# Altium schematic sheet 13. SOC EMIF1 & LPDDR4.SchDoc: LPDDR4 INTERFACE - 2
size 513 x 386 mm; Project: PROC154E2(001)_SK_AM69; Issue: 1.0; RevCode: E3; Page Create Date: March  8, 1995; Variant Name: Core Design; Schematic Page Number: 13; Page Number: 13; Page Size: C; Comment: MISTRAL_TITLEBLK_CSIZE_1; Page Count: 62; Schematic Page Count: 62; Name: PROC154E2 001 SK AM69; DsnPath: C:\Users\danie\Downloads\sprr466c\PROC154E3_RP\PROC154E3_SCH.DSN; SchematicName: SCHEMATIC1; PageName: 13. SOC EMIF1 & LPDDR4; PageSize: C; TopSchematic: True
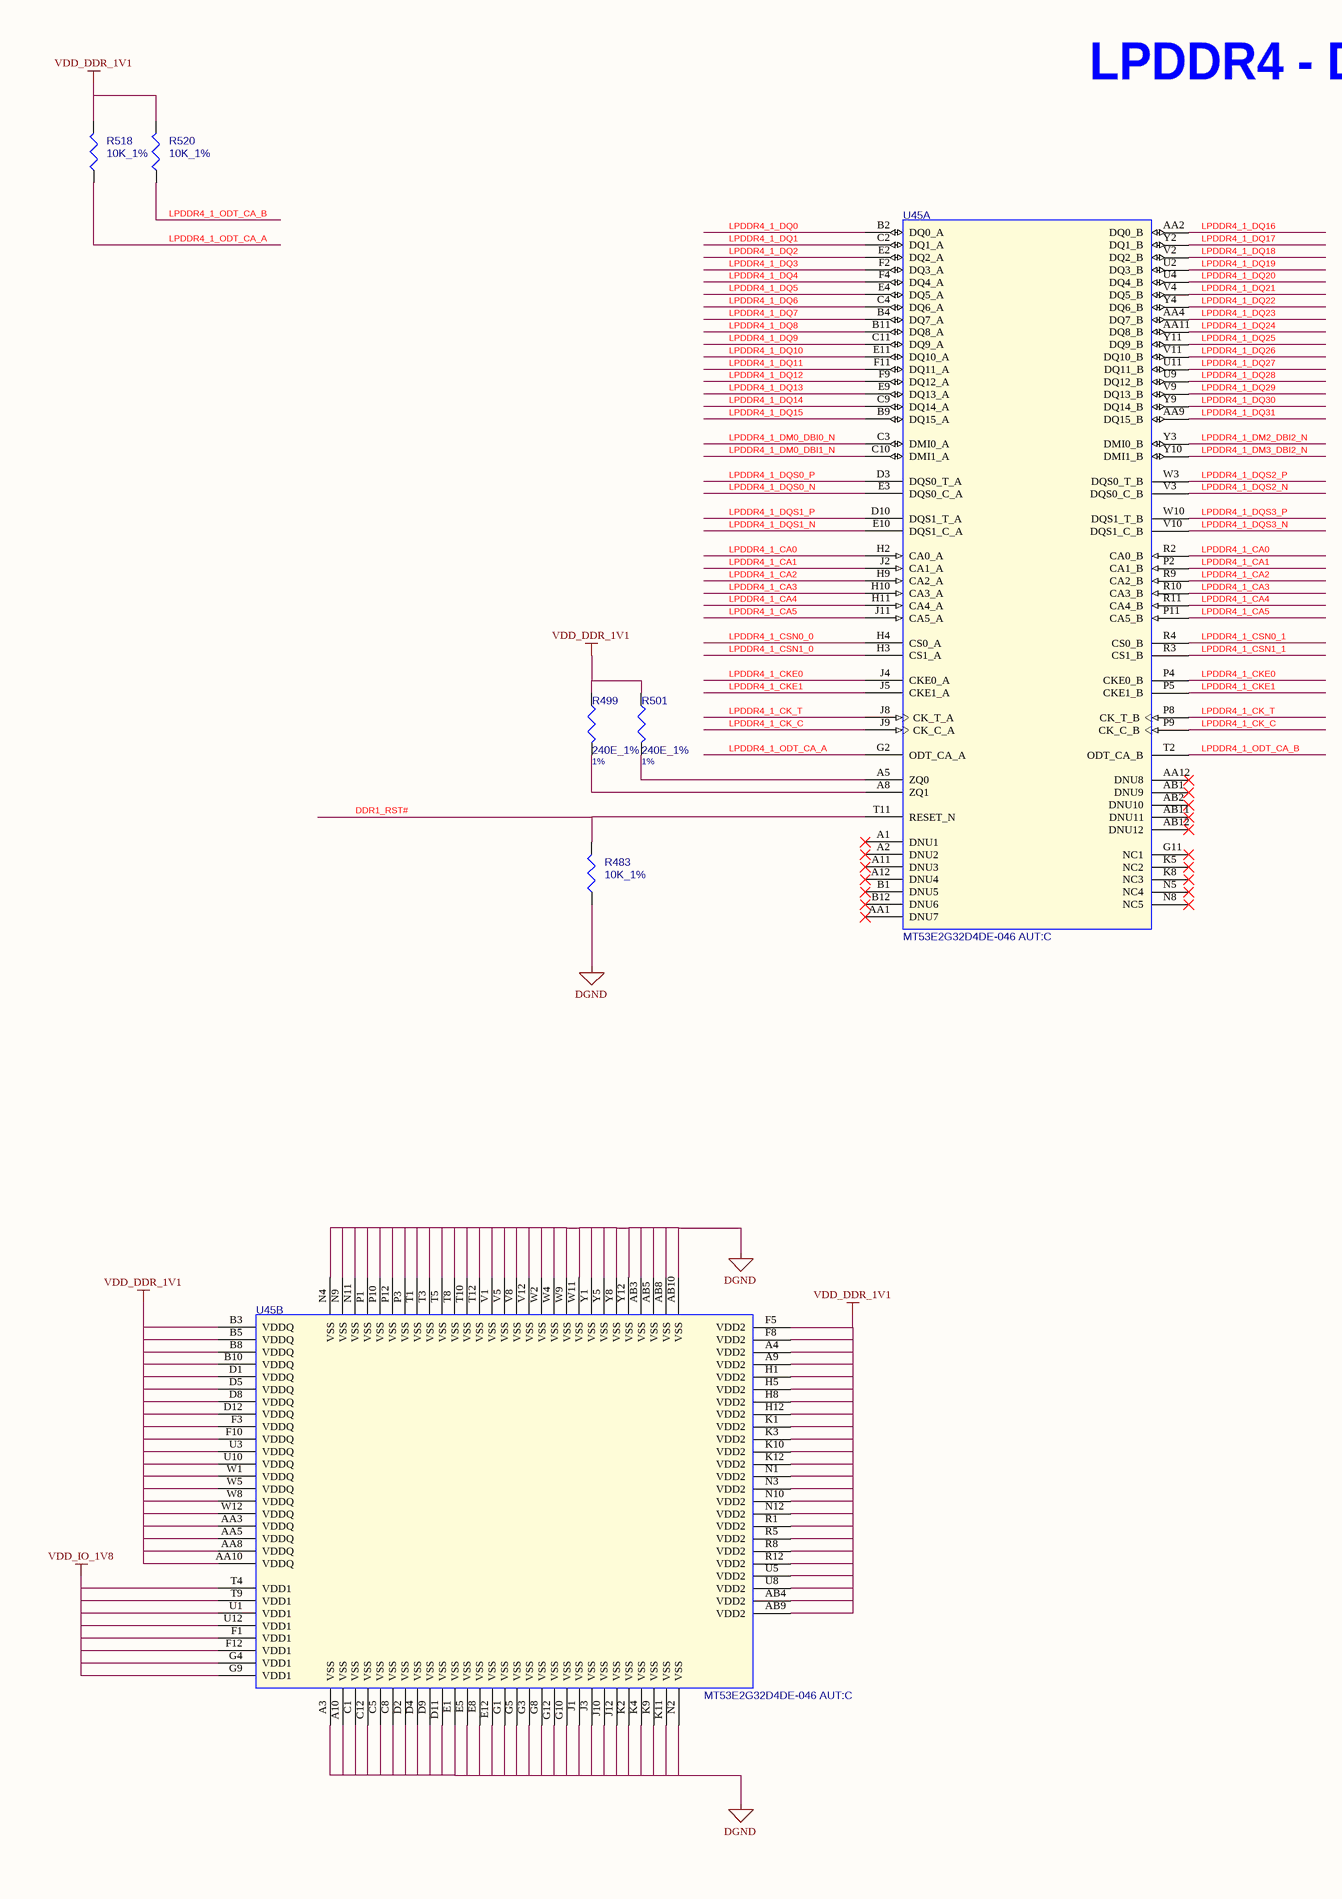
[diagram p0: 13. SOC EMIF1 & LPDDR4.SchDoc, left]
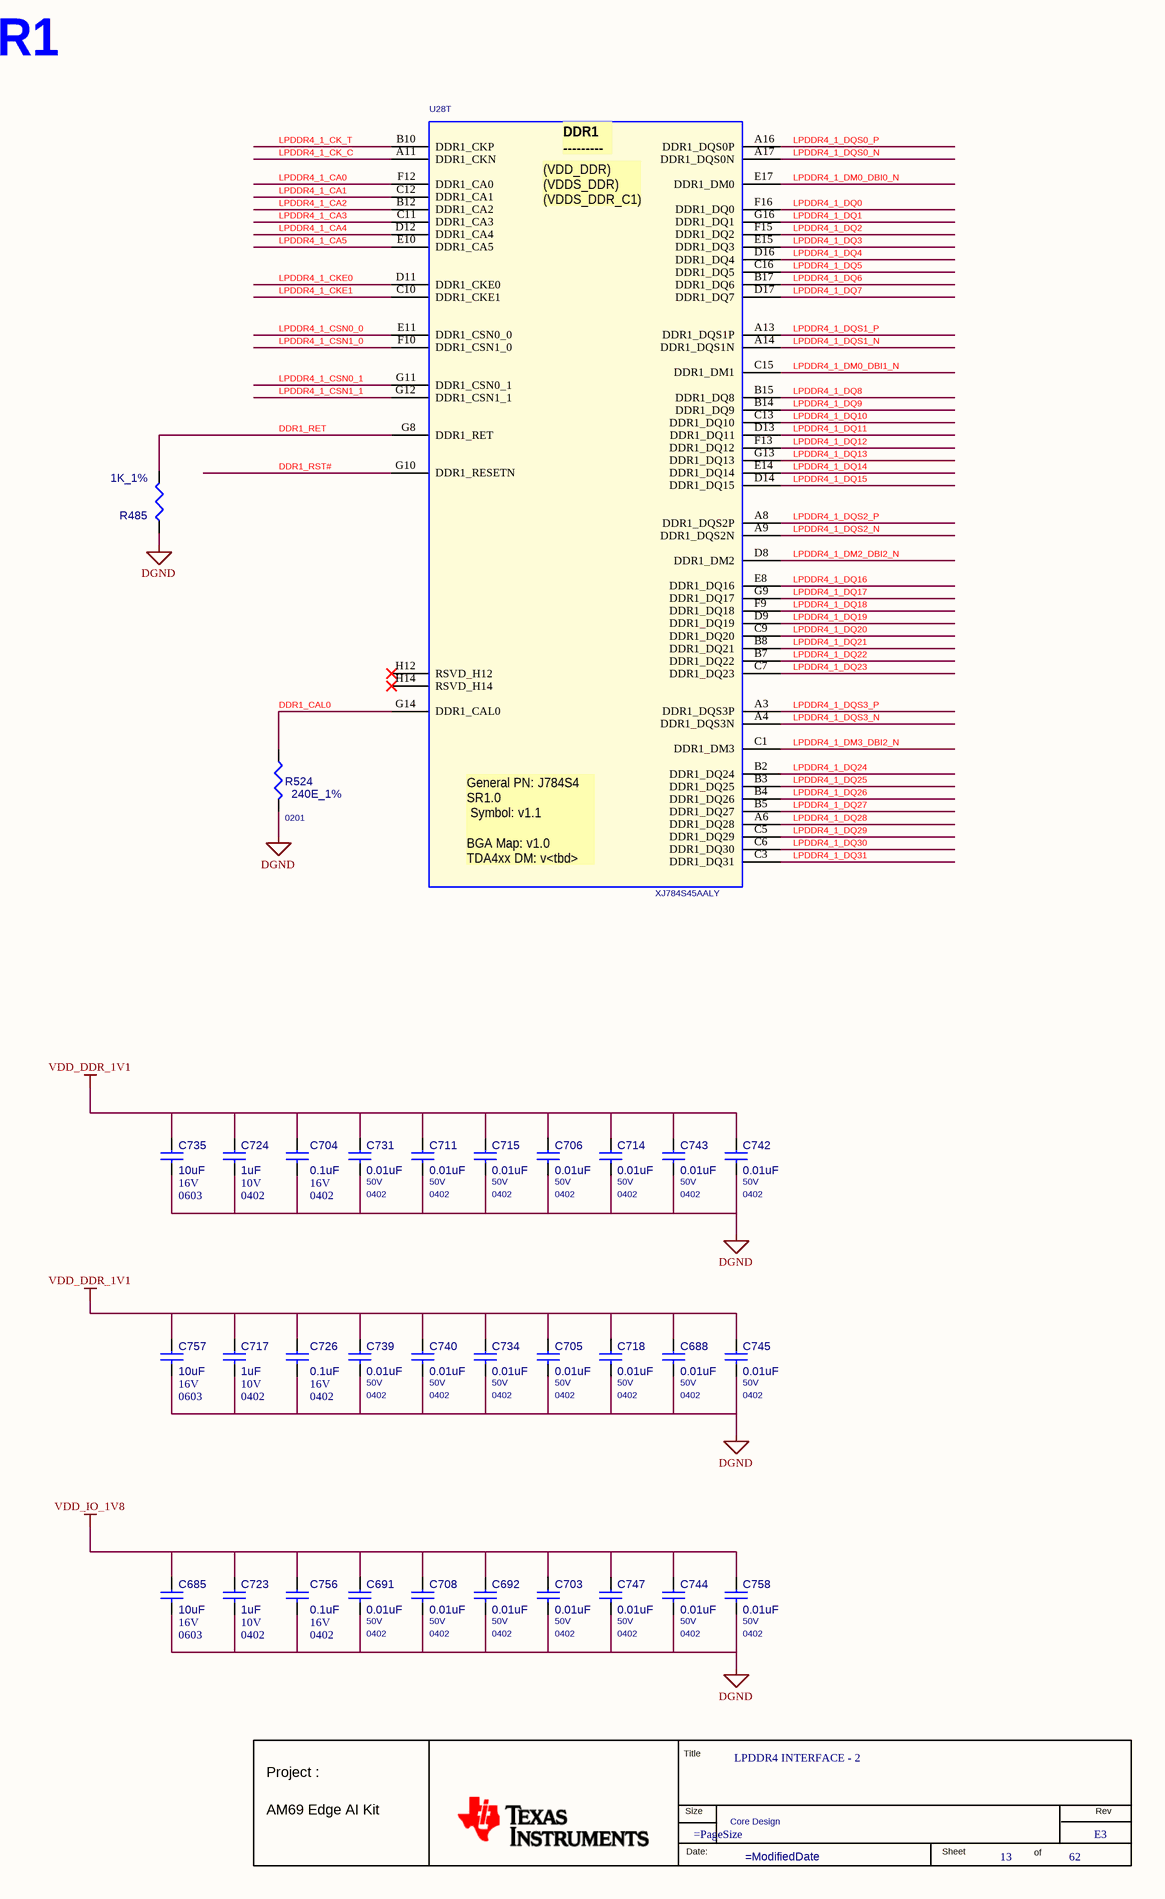
[diagram p1: 13. SOC EMIF1 & LPDDR4.SchDoc, right]

## Parts
*  RevCode: E3  Title: LPDDR4 INTERFACE - 2  Page Number: 13  Page Count: 62  Variant Name: Core Design  (hidden comment: MISTRAL_TITLEBLK_CSIZE_1)  (graphical)
C685  10uF  Package: 0603  Voltage: 16V  [CAP0603_1]
C688  0.01uF  Package: 0402  Voltage: 50V  [CAP0402_0-75]
C691  0.01uF  Voltage: 50V  Package: 0402  [CAP0402_0-75]
C692  0.01uF  Voltage: 50V  Package: 0402  [CAP0402_0-75]
C703  0.01uF  Voltage: 50V  Package: 0402  [CAP0402_0-75]
C704  0.1uF  Package: 0402  Voltage: 16V  [CAP0402_0-75]
C705  0.01uF  Package: 0402  Voltage: 50V  [CAP0402_0-75]
C706  0.01uF  Voltage: 50V  Package: 0402  [CAP0402_0-75]
C708  0.01uF  Voltage: 50V  Package: 0402  [CAP0402_0-75]
C711  0.01uF  Voltage: 50V  Package: 0402  [CAP0402_0-75]
C714  0.01uF  Voltage: 50V  Package: 0402  [CAP0402_0-75]
C715  0.01uF  Voltage: 50V  Package: 0402  [CAP0402_0-75]
C717  1uF  Voltage: 10V  Package: 0402  [CAP0402_0-75]
C718  0.01uF  Package: 0402  Voltage: 50V  [CAP0402_0-75]
C723  1uF  Package: 0402  Voltage: 10V  [CAP0402_0-75]
C724  1uF  Package: 0402  Voltage: 10V  [CAP0402_0-75]
C726  0.1uF  Voltage: 16V  Package: 0402  [CAP0402_0-75]
C731  0.01uF  Voltage: 50V  Package: 0402  [CAP0402_0-75]
C734  0.01uF  Package: 0402  Voltage: 50V  [CAP0402_0-75]
C735  10uF  Package: 0603  Voltage: 16V  [CAP0603_1]
C739  0.01uF  Package: 0402  Voltage: 50V  [CAP0402_0-75]
C740  0.01uF  Package: 0402  Voltage: 50V  [CAP0402_0-75]
C742  0.01uF  Voltage: 50V  Package: 0402  [CAP0402_0-75]
C743  0.01uF  Voltage: 50V  Package: 0402  [CAP0402_0-75]
C744  0.01uF  Voltage: 50V  Package: 0402  [CAP0402_0-75]
C745  0.01uF  Package: 0402  Voltage: 50V  [CAP0402_0-75]
C747  0.01uF  Voltage: 50V  Package: 0402  [CAP0402_0-75]
C756  0.1uF  Package: 0402  Voltage: 16V  [CAP0402_0-75]
C757  10uF  Package: 0603  Voltage: 16V  [CAP0603_1]
C758  0.01uF  Voltage: 50V  Package: 0402  [CAP0402_0-75]
R483  10K_1%  [RES0402_0-5]
R485  1K_1%  [RES0402_0-5]
R499  240E_1%  Tolerance: 1%  [RES0201_0-5]
R501  240E_1%  Tolerance: 1%  [RES0201_0-5]
R518  10K_1%  [RES0402_0-5]
R520  10K_1%  [RES0402_0-5]
R524  240E_1%  Package: 0201  [RES0201_0-5]
U28  XJ784S45AALY  [BGA1414_31-49_1230X1230_2-7]  (part T of 26)
U45  MT53E2G32D4DE-046 AUT:C  [WFBGA200_MT53DDS_400X570_1-2]  (parts A,B of 2)

## Nets
DGND: C685.2 C688.2 C691.2 C692.2 C703.2 C704.2 C705.2 C706.2 C708.2 C711.2 C714.2 C715.2 C717.2 C718.2 C723.2 C724.2 C726.2 C731.2 C734.2 C735.2 C739.2 C740.2 C742.2 C743.2 C744.2 C745.2 C747.2 C756.2 C757.2 C758.2 R483.1 R485.2 R524.2 U45.A3(VSS) U45.A10(VSS) U45.AB3(VSS) U45.AB5(VSS) U45.AB8(VSS) U45.AB10(VSS) U45.C1(VSS) U45.C5(VSS) U45.C8(VSS) U45.C12(VSS) U45.D2(VSS) U45.D4(VSS) U45.D9(VSS) U45.D11(VSS) U45.E1(VSS) U45.E5(VSS) U45.E8(VSS) U45.E12(VSS) U45.G1(VSS) U45.G3(VSS) U45.G5(VSS) U45.G8(VSS) U45.G10(VSS) U45.G12(VSS) U45.J1(VSS) U45.J3(VSS) U45.J10(VSS) U45.J12(VSS) U45.K2(VSS) U45.K4(VSS) U45.K9(VSS) U45.K11(VSS) U45.N2(VSS) U45.N4(VSS) U45.N9(VSS) U45.N11(VSS) U45.P1(VSS) U45.P3(VSS) U45.P10(VSS) U45.P12(VSS) U45.T1(VSS) U45.T3(VSS) U45.T5(VSS) U45.T8(VSS) U45.T10(VSS) U45.T12(VSS) U45.V1(VSS) U45.V5(VSS) U45.V8(VSS) U45.V12(VSS) U45.W2(VSS) U45.W4(VSS) U45.W9(VSS) U45.W11(VSS) U45.Y1(VSS) U45.Y5(VSS) U45.Y8(VSS) U45.Y12(VSS)
VDD_DDR_1V1: C688.1 C704.1 C705.1 C706.1 C711.1 C714.1 C715.1 C717.1 C718.1 C724.1 C726.1 C731.1 C734.1 C735.1 C739.1 C740.1 C742.1 C743.1 C745.1 C757.1 R499.1 R501.1 R518.2 R520.2 U45.A4(VDD2) U45.A9(VDD2) U45.AA3(VDDQ) U45.AA5(VDDQ) U45.AA8(VDDQ) U45.AA10(VDDQ) U45.AB4(VDD2) U45.AB9(VDD2) U45.B3(VDDQ) U45.B5(VDDQ) U45.B8(VDDQ) U45.B10(VDDQ) U45.D1(VDDQ) U45.D5(VDDQ) U45.D8(VDDQ) U45.D12(VDDQ) U45.F3(VDDQ) U45.F5(VDD2) U45.F8(VDD2) U45.F10(VDDQ) U45.H1(VDD2) U45.H5(VDD2) U45.H8(VDD2) U45.H12(VDD2) U45.K1(VDD2) U45.K3(VDD2) U45.K10(VDD2) U45.K12(VDD2) U45.N1(VDD2) U45.N3(VDD2) U45.N10(VDD2) U45.N12(VDD2) U45.R1(VDD2) U45.R5(VDD2) U45.R8(VDD2) U45.R12(VDD2) U45.U3(VDDQ) U45.U5(VDD2) U45.U8(VDD2) U45.U10(VDDQ) U45.W1(VDDQ) U45.W5(VDDQ) U45.W8(VDDQ) U45.W12(VDDQ)
VDD_IO_1V8: C685.1 C691.1 C692.1 C703.1 C708.1 C723.1 C744.1 C747.1 C756.1 C758.1 U45.F1(VDD1) U45.F12(VDD1) U45.G4(VDD1) U45.G9(VDD1) U45.T4(VDD1) U45.T9(VDD1) U45.U1(VDD1) U45.U12(VDD1)
DDR1_CAL0: R524.1 U28.G14(DDR1_CAL0)
DDR1_RET: R485.1 U28.G8(DDR1_RET)
DDR1_RST#: R483.2 U28.G10(DDR1_RESETN) U45.T11(RESET_N)
LPDDR4_1_CA0: U28.F12(DDR1_CA0) U45.H2(CA0_A) U45.R2(CA0_B)
LPDDR4_1_CA1: U28.C12(DDR1_CA1) U45.J2(CA1_A) U45.P2(CA1_B)
LPDDR4_1_CA2: U28.B12(DDR1_CA2) U45.H9(CA2_A) U45.R9(CA2_B)
LPDDR4_1_CA3: U28.C11(DDR1_CA3) U45.H10(CA3_A) U45.R10(CA3_B)
LPDDR4_1_CA4: U28.D12(DDR1_CA4) U45.H11(CA4_A) U45.R11(CA4_B)
LPDDR4_1_CA5: U28.E10(DDR1_CA5) U45.J11(CA5_A) U45.P11(CA5_B)
LPDDR4_1_CK_C: U28.A11(DDR1_CKN) U45.J9(CK_C_A) U45.P9(CK_C_B)
LPDDR4_1_CK_T: U28.B10(DDR1_CKP) U45.J8(CK_T_A) U45.P8(CK_T_B)
LPDDR4_1_CKE0: U28.D11(DDR1_CKE0) U45.J4(CKE0_A) U45.P4(CKE0_B)
LPDDR4_1_CKE1: U28.C10(DDR1_CKE1) U45.J5(CKE1_A) U45.P5(CKE1_B)
LPDDR4_1_CSN0_0: U28.E11(DDR1_CSN0_0) U45.H4(CS0_A)
LPDDR4_1_CSN0_1: U28.G11(DDR1_CSN0_1) U45.R4(CS0_B)
LPDDR4_1_CSN1_0: U28.F10(DDR1_CSN1_0) U45.H3(CS1_A)
LPDDR4_1_CSN1_1: U28.G12(DDR1_CSN1_1) U45.R3(CS1_B)
LPDDR4_1_DM0_DBI0_N: U28.E17(DDR1_DM0) U45.C3(DMI0_A)
LPDDR4_1_DM0_DBI1_N: U28.C15(DDR1_DM1) U45.C10(DMI1_A)
LPDDR4_1_DM2_DBI2_N: U28.D8(DDR1_DM2) U45.Y3(DMI0_B)
LPDDR4_1_DM3_DBI2_N: U28.C1(DDR1_DM3) U45.Y10(DMI1_B)
LPDDR4_1_DQ0: U28.F16(DDR1_DQ0) U45.B2(DQ0_A)
LPDDR4_1_DQ1: U28.G16(DDR1_DQ1) U45.C2(DQ1_A)
LPDDR4_1_DQ2: U28.F15(DDR1_DQ2) U45.E2(DQ2_A)
LPDDR4_1_DQ3: U28.E15(DDR1_DQ3) U45.F2(DQ3_A)
LPDDR4_1_DQ4: U28.D16(DDR1_DQ4) U45.F4(DQ4_A)
LPDDR4_1_DQ5: U28.C16(DDR1_DQ5) U45.E4(DQ5_A)
LPDDR4_1_DQ6: U28.B17(DDR1_DQ6) U45.C4(DQ6_A)
LPDDR4_1_DQ7: U28.D17(DDR1_DQ7) U45.B4(DQ7_A)
LPDDR4_1_DQ8: U28.B15(DDR1_DQ8) U45.B11(DQ8_A)
LPDDR4_1_DQ9: U28.B14(DDR1_DQ9) U45.C11(DQ9_A)
LPDDR4_1_DQ10: U28.C13(DDR1_DQ10) U45.E11(DQ10_A)
LPDDR4_1_DQ11: U28.D13(DDR1_DQ11) U45.F11(DQ11_A)
LPDDR4_1_DQ12: U28.F13(DDR1_DQ12) U45.F9(DQ12_A)
LPDDR4_1_DQ13: U28.G13(DDR1_DQ13) U45.E9(DQ13_A)
LPDDR4_1_DQ14: U28.E14(DDR1_DQ14) U45.C9(DQ14_A)
LPDDR4_1_DQ15: U28.D14(DDR1_DQ15) U45.B9(DQ15_A)
LPDDR4_1_DQ16: U28.E8(DDR1_DQ16) U45.AA2(DQ0_B)
LPDDR4_1_DQ17: U28.G9(DDR1_DQ17) U45.Y2(DQ1_B)
LPDDR4_1_DQ18: U28.F9(DDR1_DQ18) U45.V2(DQ2_B)
LPDDR4_1_DQ19: U28.D9(DDR1_DQ19) U45.U2(DQ3_B)
LPDDR4_1_DQ20: U28.C9(DDR1_DQ20) U45.U4(DQ4_B)
LPDDR4_1_DQ21: U28.B8(DDR1_DQ21) U45.V4(DQ5_B)
LPDDR4_1_DQ22: U28.B7(DDR1_DQ22) U45.Y4(DQ6_B)
LPDDR4_1_DQ23: U28.C7(DDR1_DQ23) U45.AA4(DQ7_B)
LPDDR4_1_DQ24: U28.B2(DDR1_DQ24) U45.AA11(DQ8_B)
LPDDR4_1_DQ25: U28.B3(DDR1_DQ25) U45.Y11(DQ9_B)
LPDDR4_1_DQ26: U28.B4(DDR1_DQ26) U45.V11(DQ10_B)
LPDDR4_1_DQ27: U28.B5(DDR1_DQ27) U45.U11(DQ11_B)
LPDDR4_1_DQ28: U28.A6(DDR1_DQ28) U45.U9(DQ12_B)
LPDDR4_1_DQ29: U28.C5(DDR1_DQ29) U45.V9(DQ13_B)
LPDDR4_1_DQ30: U28.C6(DDR1_DQ30) U45.Y9(DQ14_B)
LPDDR4_1_DQ31: U28.C3(DDR1_DQ31) U45.AA9(DQ15_B)
LPDDR4_1_DQS0_N: U28.A17(DDR1_DQS0N) U45.E3(DQS0_C_A)
LPDDR4_1_DQS0_P: U28.A16(DDR1_DQS0P) U45.D3(DQS0_T_A)
LPDDR4_1_DQS1_N: U28.A14(DDR1_DQS1N) U45.E10(DQS1_C_A)
LPDDR4_1_DQS1_P: U28.A13(DDR1_DQS1P) U45.D10(DQS1_T_A)
LPDDR4_1_DQS2_N: U28.A9(DDR1_DQS2N) U45.V3(DQS0_C_B)
LPDDR4_1_DQS2_P: U28.A8(DDR1_DQS2P) U45.W3(DQS0_T_B)
LPDDR4_1_DQS3_N: U28.A4(DDR1_DQS3N) U45.V10(DQS1_C_B)
LPDDR4_1_DQS3_P: U28.A3(DDR1_DQS3P) U45.W10(DQS1_T_B)
LPDDR4_1_ODT_CA_A: R518.1 U45.G2(ODT_CA_A)
LPDDR4_1_ODT_CA_B: R520.1 U45.T2(ODT_CA_B)
NetR499_2: R499.2 U45.A8(ZQ1)
NetR501_2: R501.2 U45.A5(ZQ0)

Not connected (* = marked no-connect by the designer): U28 H12(RSVD_H12)* H14(RSVD_H14)*; U45 A1(DNU1)* A2(DNU2)* A11(DNU3)* A12(DNU4)* AA1(DNU7)* AA12(DNU8)* AB1(DNU9)* AB2(DNU10)* AB11(DNU11)* AB12(DNU12)* B1(DNU5)* B12(DNU6)* G11(NC1)* K5(NC2)* K8(NC3)* N5(NC4)* N8(NC5)*

## Notes on the sheet
- LPDDR4 - DDR1
- (in symbol J7AHPSoC-EVM_BGA1414, part T) DDR1 / ---------; (VDD_DDR) / (VDDS_DDR) / (VDDS_DDR_C1); General PN: J784S4 / SR1.0 / Symbol: v1.1 / BGA Map: v1.0 / TDA4xx DM: v<tbd>
- (in symbol MISTRAL_TITLEBLK_CSIZE_1) Title; Project :; Size; Rev; AM69 Edge AI Kit; Date:; Sheet; of

## Library data of the parts
* = MISTRAL_TITLEBLK_CSIZE_1: Issue: 1.0; Project: PROC154E2(001)_SK_AM69; Name: PROC154E2 001 SK AM69; Page Create Date: March  8, 1995; Page Size: =PageSize; Page Modify Date: =ModifiedDate; Schematic Page Count: 62; Schematic Page Number: 13
C685 = CAP_Dup1: CAP CERAMIC 10uF 16V 20% X6S 0603; Part Reference: C685; Automotive Alternate_mfr_part_number: GRT188C81C106ME13D; Automotive Alternate_mfr_name: MURATA; Direct Alternate_mfr_part_number: CL10X106MO8NRNC; Direct Alternate_mfr_name: SAMSUNG; Part_type: CAPACITORS\CERAMIC; Mfr_part_number: GRM188C81C106MA73D; Mistral Part No: 120017010004-R; Custom_Duty: 15%; Customs_HS_Code: 85322990; Wattage: NA; Project: TRMM_SMART-M_PS; Value: 10uF; PCB Footprint: CAP0603_1; Footprint Path: Y:\MIS_DATABASE\Library\ALTIUM_TOOL\PCB_FOOTPRINTS\Altium_Footprint_Lib.PcbLib; Library Path: Y:\MIS_DATABASE\Library\ALTIUM_TOOL\SCHEMATICS_PARTS\MS_DISCRETE_Library.schlib; Footprint Ref: CAP0603_1; MECHANICAL 3D STEP FILE: CAP0603_1; Chkd/date: VASANTHA/170117; Crtd /date: VASANTHA/170117; Datasheet: Y:\MIS_DATABASE\DATASHEETS\CAPACITORS\MURATA-GXX-SER_NOV17.PDF; Temperature: -55°C+105°C; Weight: 6.3mg; Height: 0.90MM; Library Ref: CAP; Distributor_part_number: 490-7198-1-ND; Distributor_name: DIGIKEY; Tolerance: 20%; Mfr_name: MURATA
C688 = CAP_Dup1: CAP CERAMIC 0.01uF 50V 10% X7R 0402; Part Reference: C688; Automotive Alternate_mfr_part_number: CGA2B3X7R1H103K050BB; Automotive Alternate_mfr_name: TDK; Direct Alternate_mfr_part_number: C1005X7R1H103K050BE; Part_type: CAPACITORS\CERAMIC; Mfr_part_number: C0402C103K5RACTU; Mfr_name: KEMET; Mistral Part No: 120009030025-R; Wattage: NA; Custom_Duty: 15%; Customs_HS_Code: 85322990; Project: G4_SVGA; Value: 0.01uF; PCB Footprint: CAP0402_0-75; Direct Alternate_mfr_name: TDK; Footprint Path: Y:\MIS_DATABASE\Library\ALTIUM_TOOL\PCB_FOOTPRINTS\Altium_Footprint_Lib.PcbLib; Library Path: Y:\MIS_DATABASE\Library\ALTIUM_TOOL\SCHEMATICS_PARTS\MS_DISCRETE_Library.schlib; MECHANICAL 3D STEP FILE: CAP0402_0-75; Temperature: -55°C+125°C; Weight: 0.65mg; Footprint Ref: CAP0402_0-75; Chkd/date: SHREESHAIL/301105; Crtd /date: MAZHAR/040505; Datasheet: Y:\MIS_DATABASE\DATASHEETS\CAPACITORS\KEMET-C-X7R.PDF; Height: 0.55MM; Library Ref: CAP; Distributor_part_number: 399-3066-1-ND; Distributor_name: DIGIKEY; Tolerance: 10%
C691 = CAP_Dup1: CAP CERAMIC 0.01uF 50V 10% X7R 0402; Part Reference: C691; Mistral Part No: 120009030025-R; Mfr_name: KEMET; Mfr_part_number: C0402C103K5RACTU; Part_type: CAPACITORS\CERAMIC; Direct Alternate_mfr_name: TDK; Direct Alternate_mfr_part_number: C1005X7R1H103K050BE; Automotive Alternate_mfr_part_number: CGA2B3X7R1H103K050BB; Project: G4_SVGA; Customs_HS_Code: 85322990; Custom_Duty: 15%; Wattage: NA; Value: 0.01uF; PCB Footprint: CAP0402_0-75; Tolerance: 10%; Distributor_name: DIGIKEY; Distributor_part_number: 399-3066-1-ND; Library Ref: CAP; Height: 0.55MM; Datasheet: Y:\MIS_DATABASE\DATASHEETS\CAPACITORS\KEMET-C-X7R.PDF; Crtd /date: MAZHAR/040505; Chkd/date: SHREESHAIL/301105; Footprint Ref: CAP0402_0-75; Weight: 0.65mg; Temperature: -55°C+125°C; MECHANICAL 3D STEP FILE: CAP0402_0-75; Library Path: Y:\MIS_DATABASE\Library\ALTIUM_TOOL\SCHEMATICS_PARTS\MS_DISCRETE_Library.schlib; Footprint Path: Y:\MIS_DATABASE\Library\ALTIUM_TOOL\PCB_FOOTPRINTS\Altium_Footprint_Lib.PcbLib; Automotive Alternate_mfr_name: TDK
C692 = CAP_Dup1: CAP CERAMIC 0.01uF 50V 10% X7R 0402; Part Reference: C692; Mistral Part No: 120009030025-R; Mfr_name: KEMET; Mfr_part_number: C0402C103K5RACTU; Part_type: CAPACITORS\CERAMIC; Direct Alternate_mfr_name: TDK; Direct Alternate_mfr_part_number: C1005X7R1H103K050BE; Automotive Alternate_mfr_part_number: CGA2B3X7R1H103K050BB; Project: G4_SVGA; Customs_HS_Code: 85322990; Custom_Duty: 15%; Wattage: NA; Value: 0.01uF; PCB Footprint: CAP0402_0-75; Tolerance: 10%; Distributor_name: DIGIKEY; Distributor_part_number: 399-3066-1-ND; Library Ref: CAP; Height: 0.55MM; Datasheet: Y:\MIS_DATABASE\DATASHEETS\CAPACITORS\KEMET-C-X7R.PDF; Crtd /date: MAZHAR/040505; Chkd/date: SHREESHAIL/301105; Footprint Ref: CAP0402_0-75; Weight: 0.65mg; Temperature: -55°C+125°C; MECHANICAL 3D STEP FILE: CAP0402_0-75; Library Path: Y:\MIS_DATABASE\Library\ALTIUM_TOOL\SCHEMATICS_PARTS\MS_DISCRETE_Library.schlib; Footprint Path: Y:\MIS_DATABASE\Library\ALTIUM_TOOL\PCB_FOOTPRINTS\Altium_Footprint_Lib.PcbLib; Automotive Alternate_mfr_name: TDK
C703 = CAP_Dup1: CAP CERAMIC 0.01uF 50V 10% X7R 0402; Part Reference: C703; Mistral Part No: 120009030025-R; Mfr_name: KEMET; Mfr_part_number: C0402C103K5RACTU; Part_type: CAPACITORS\CERAMIC; Direct Alternate_mfr_name: TDK; Direct Alternate_mfr_part_number: C1005X7R1H103K050BE; Automotive Alternate_mfr_part_number: CGA2B3X7R1H103K050BB; Project: G4_SVGA; Customs_HS_Code: 85322990; Custom_Duty: 15%; Wattage: NA; Value: 0.01uF; PCB Footprint: CAP0402_0-75; Tolerance: 10%; Distributor_name: DIGIKEY; Distributor_part_number: 399-3066-1-ND; Library Ref: CAP; Height: 0.55MM; Datasheet: Y:\MIS_DATABASE\DATASHEETS\CAPACITORS\KEMET-C-X7R.PDF; Crtd /date: MAZHAR/040505; Chkd/date: SHREESHAIL/301105; Footprint Ref: CAP0402_0-75; Weight: 0.65mg; Temperature: -55°C+125°C; MECHANICAL 3D STEP FILE: CAP0402_0-75; Library Path: Y:\MIS_DATABASE\Library\ALTIUM_TOOL\SCHEMATICS_PARTS\MS_DISCRETE_Library.schlib; Footprint Path: Y:\MIS_DATABASE\Library\ALTIUM_TOOL\PCB_FOOTPRINTS\Altium_Footprint_Lib.PcbLib; Automotive Alternate_mfr_name: TDK
C704 = CAP_Dup1: CAP CERAMIC 0.1uF 16V 5% X7R AUTO 0402; Part Reference: C704; Part_type: CAPACITORS\CERAMIC; Mfr_part_number: GCM155R71C104JA55D; Mfr_name: MURATA; Mistral Part No: 120018100055-R; Direct Alternate_mfr_name: TDK; Direct Alternate_mfr_part_number: CGA2B1X7R1C104K050BC; Custom_Duty: 15%; Customs_HS_Code: 85322990; Wattage: NA; Project: TI_J7ES_EVM_CP; Value: 0.1uF; PCB Footprint: CAP0402_0-75; MECHANICAL 3D STEP FILE: CAP0402_0-75; Footprint Path: Y:\MIS_DATABASE\Library\ALTIUM_TOOL\PCB_FOOTPRINTS\Altium_Footprint_Lib.PcbLib; Library Path: Y:\MIS_DATABASE\Library\ALTIUM_TOOL\SCHEMATICS_PARTS\MS_DISCRETE_Library.schlib; Footprint Ref: CAP0402_0-75; Library Ref: CAP; Chkd/date: MANIRAJA/241018; Crtd /date: ALVY/241018; Datasheet: Y:\MIS_DATABASE\DATASHEETS\CAPACITORS\GCM155R71C104JA55D.PDF; Temperature: -55°C+125°C; Weight: 6mg; Height: 0.55MM; Distributor_part_number: 490-16433-1-ND; Distributor_name: DIGIKEY; Tolerance: 5%; Automotive Alternate_mfr_name: TDK; Automotive Alternate_mfr_part_number: CGA2B1X7R1C104K050BC
C705 = CAP_Dup1: CAP CERAMIC 0.01uF 50V 10% X7R 0402; Part Reference: C705; Automotive Alternate_mfr_part_number: CGA2B3X7R1H103K050BB; Automotive Alternate_mfr_name: TDK; Direct Alternate_mfr_part_number: C1005X7R1H103K050BE; Part_type: CAPACITORS\CERAMIC; Mfr_part_number: C0402C103K5RACTU; Mfr_name: KEMET; Mistral Part No: 120009030025-R; Wattage: NA; Custom_Duty: 15%; Customs_HS_Code: 85322990; Project: G4_SVGA; Value: 0.01uF; PCB Footprint: CAP0402_0-75; Direct Alternate_mfr_name: TDK; Footprint Path: Y:\MIS_DATABASE\Library\ALTIUM_TOOL\PCB_FOOTPRINTS\Altium_Footprint_Lib.PcbLib; Library Path: Y:\MIS_DATABASE\Library\ALTIUM_TOOL\SCHEMATICS_PARTS\MS_DISCRETE_Library.schlib; MECHANICAL 3D STEP FILE: CAP0402_0-75; Temperature: -55°C+125°C; Weight: 0.65mg; Footprint Ref: CAP0402_0-75; Chkd/date: SHREESHAIL/301105; Crtd /date: MAZHAR/040505; Datasheet: Y:\MIS_DATABASE\DATASHEETS\CAPACITORS\KEMET-C-X7R.PDF; Height: 0.55MM; Library Ref: CAP; Distributor_part_number: 399-3066-1-ND; Distributor_name: DIGIKEY; Tolerance: 10%
C706 = CAP_Dup1: CAP CERAMIC 0.01uF 50V 10% X7R 0402; Part Reference: C706; Mistral Part No: 120009030025-R; Mfr_name: KEMET; Mfr_part_number: C0402C103K5RACTU; Part_type: CAPACITORS\CERAMIC; Direct Alternate_mfr_name: TDK; Direct Alternate_mfr_part_number: C1005X7R1H103K050BE; Automotive Alternate_mfr_part_number: CGA2B3X7R1H103K050BB; Project: G4_SVGA; Customs_HS_Code: 85322990; Custom_Duty: 15%; Wattage: NA; Value: 0.01uF; PCB Footprint: CAP0402_0-75; Tolerance: 10%; Distributor_name: DIGIKEY; Distributor_part_number: 399-3066-1-ND; Library Ref: CAP; Height: 0.55MM; Datasheet: Y:\MIS_DATABASE\DATASHEETS\CAPACITORS\KEMET-C-X7R.PDF; Crtd /date: MAZHAR/040505; Chkd/date: SHREESHAIL/301105; Footprint Ref: CAP0402_0-75; Weight: 0.65mg; Temperature: -55°C+125°C; MECHANICAL 3D STEP FILE: CAP0402_0-75; Library Path: Y:\MIS_DATABASE\Library\ALTIUM_TOOL\SCHEMATICS_PARTS\MS_DISCRETE_Library.schlib; Footprint Path: Y:\MIS_DATABASE\Library\ALTIUM_TOOL\PCB_FOOTPRINTS\Altium_Footprint_Lib.PcbLib; Automotive Alternate_mfr_name: TDK
C708 = CAP_Dup1: CAP CERAMIC 0.01uF 50V 10% X7R 0402; Part Reference: C708; Mistral Part No: 120009030025-R; Mfr_name: KEMET; Mfr_part_number: C0402C103K5RACTU; Part_type: CAPACITORS\CERAMIC; Direct Alternate_mfr_name: TDK; Direct Alternate_mfr_part_number: C1005X7R1H103K050BE; Automotive Alternate_mfr_part_number: CGA2B3X7R1H103K050BB; Project: G4_SVGA; Customs_HS_Code: 85322990; Custom_Duty: 15%; Wattage: NA; Value: 0.01uF; PCB Footprint: CAP0402_0-75; Tolerance: 10%; Distributor_name: DIGIKEY; Distributor_part_number: 399-3066-1-ND; Library Ref: CAP; Height: 0.55MM; Datasheet: Y:\MIS_DATABASE\DATASHEETS\CAPACITORS\KEMET-C-X7R.PDF; Crtd /date: MAZHAR/040505; Chkd/date: SHREESHAIL/301105; Footprint Ref: CAP0402_0-75; Weight: 0.65mg; Temperature: -55°C+125°C; MECHANICAL 3D STEP FILE: CAP0402_0-75; Library Path: Y:\MIS_DATABASE\Library\ALTIUM_TOOL\SCHEMATICS_PARTS\MS_DISCRETE_Library.schlib; Footprint Path: Y:\MIS_DATABASE\Library\ALTIUM_TOOL\PCB_FOOTPRINTS\Altium_Footprint_Lib.PcbLib; Automotive Alternate_mfr_name: TDK
C711 = CAP_Dup1: CAP CERAMIC 0.01uF 50V 10% X7R 0402; Part Reference: C711; Mistral Part No: 120009030025-R; Mfr_name: KEMET; Mfr_part_number: C0402C103K5RACTU; Part_type: CAPACITORS\CERAMIC; Direct Alternate_mfr_name: TDK; Direct Alternate_mfr_part_number: C1005X7R1H103K050BE; Automotive Alternate_mfr_part_number: CGA2B3X7R1H103K050BB; Project: G4_SVGA; Customs_HS_Code: 85322990; Custom_Duty: 15%; Wattage: NA; Value: 0.01uF; PCB Footprint: CAP0402_0-75; Tolerance: 10%; Distributor_name: DIGIKEY; Distributor_part_number: 399-3066-1-ND; Library Ref: CAP; Height: 0.55MM; Datasheet: Y:\MIS_DATABASE\DATASHEETS\CAPACITORS\KEMET-C-X7R.PDF; Crtd /date: MAZHAR/040505; Chkd/date: SHREESHAIL/301105; Footprint Ref: CAP0402_0-75; Weight: 0.65mg; Temperature: -55°C+125°C; MECHANICAL 3D STEP FILE: CAP0402_0-75; Library Path: Y:\MIS_DATABASE\Library\ALTIUM_TOOL\SCHEMATICS_PARTS\MS_DISCRETE_Library.schlib; Footprint Path: Y:\MIS_DATABASE\Library\ALTIUM_TOOL\PCB_FOOTPRINTS\Altium_Footprint_Lib.PcbLib; Automotive Alternate_mfr_name: TDK
C714 = CAP_Dup1: CAP CERAMIC 0.01uF 50V 10% X7R 0402; Part Reference: C714; Mistral Part No: 120009030025-R; Mfr_name: KEMET; Mfr_part_number: C0402C103K5RACTU; Part_type: CAPACITORS\CERAMIC; Direct Alternate_mfr_name: TDK; Direct Alternate_mfr_part_number: C1005X7R1H103K050BE; Automotive Alternate_mfr_part_number: CGA2B3X7R1H103K050BB; Project: G4_SVGA; Customs_HS_Code: 85322990; Custom_Duty: 15%; Wattage: NA; Value: 0.01uF; PCB Footprint: CAP0402_0-75; Tolerance: 10%; Distributor_name: DIGIKEY; Distributor_part_number: 399-3066-1-ND; Library Ref: CAP; Height: 0.55MM; Datasheet: Y:\MIS_DATABASE\DATASHEETS\CAPACITORS\KEMET-C-X7R.PDF; Crtd /date: MAZHAR/040505; Chkd/date: SHREESHAIL/301105; Footprint Ref: CAP0402_0-75; Weight: 0.65mg; Temperature: -55°C+125°C; MECHANICAL 3D STEP FILE: CAP0402_0-75; Library Path: Y:\MIS_DATABASE\Library\ALTIUM_TOOL\SCHEMATICS_PARTS\MS_DISCRETE_Library.schlib; Footprint Path: Y:\MIS_DATABASE\Library\ALTIUM_TOOL\PCB_FOOTPRINTS\Altium_Footprint_Lib.PcbLib; Automotive Alternate_mfr_name: TDK
C715 = CAP_Dup1: CAP CERAMIC 0.01uF 50V 10% X7R 0402; Part Reference: C715; Mistral Part No: 120009030025-R; Mfr_name: KEMET; Mfr_part_number: C0402C103K5RACTU; Part_type: CAPACITORS\CERAMIC; Direct Alternate_mfr_name: TDK; Direct Alternate_mfr_part_number: C1005X7R1H103K050BE; Automotive Alternate_mfr_part_number: CGA2B3X7R1H103K050BB; Project: G4_SVGA; Customs_HS_Code: 85322990; Custom_Duty: 15%; Wattage: NA; Value: 0.01uF; PCB Footprint: CAP0402_0-75; Tolerance: 10%; Distributor_name: DIGIKEY; Distributor_part_number: 399-3066-1-ND; Library Ref: CAP; Height: 0.55MM; Datasheet: Y:\MIS_DATABASE\DATASHEETS\CAPACITORS\KEMET-C-X7R.PDF; Crtd /date: MAZHAR/040505; Chkd/date: SHREESHAIL/301105; Footprint Ref: CAP0402_0-75; Weight: 0.65mg; Temperature: -55°C+125°C; MECHANICAL 3D STEP FILE: CAP0402_0-75; Library Path: Y:\MIS_DATABASE\Library\ALTIUM_TOOL\SCHEMATICS_PARTS\MS_DISCRETE_Library.schlib; Footprint Path: Y:\MIS_DATABASE\Library\ALTIUM_TOOL\PCB_FOOTPRINTS\Altium_Footprint_Lib.PcbLib; Automotive Alternate_mfr_name: TDK
C717 = CAP_Dup1: CAP CERAMIC 1uF 10V 10% X7S AUTO 0402; Part Reference: C717; Mistral Part No: 120018090021-R; Mfr_name: MURATA; Mfr_part_number: GCM155C71A105KE38D; Part_type: CAPACITORS\CERAMIC; Project: SMART-M_SCRIPTALK_PB; Wattage: NA; Customs_HS_Code: 85322990; Custom_Duty: 15%; Value: 1uF; PCB Footprint: CAP0402_0-75; Footprint Ref: CAP0402_0-75; Library Ref: CAP; Tolerance: 10%; Distributor_name: DIGIKEY; Distributor_part_number: 490-13409-1-ND; Height: 0.70MM; Weight: 6mg; Temperature: -55°C+125°C; Datasheet: Y:\MIS_DATABASE\DATASHEETS\CAPACITORS\MURATA-GCM-SER.PDF; Crtd /date: ALVY/100918; Chkd/date: MANIRAJA/100918; MECHANICAL 3D STEP FILE: CAP0402_0-75; Library Path: Y:\MIS_DATABASE\Library\ALTIUM_TOOL\SCHEMATICS_PARTS\MS_DISCRETE_Library.schlib; Footprint Path: Y:\MIS_DATABASE\Library\ALTIUM_TOOL\PCB_FOOTPRINTS\Altium_Footprint_Lib.PcbLib
C718 = CAP_Dup1: CAP CERAMIC 0.01uF 50V 10% X7R 0402; Part Reference: C718; Automotive Alternate_mfr_part_number: CGA2B3X7R1H103K050BB; Automotive Alternate_mfr_name: TDK; Direct Alternate_mfr_part_number: C1005X7R1H103K050BE; Part_type: CAPACITORS\CERAMIC; Mfr_part_number: C0402C103K5RACTU; Mfr_name: KEMET; Mistral Part No: 120009030025-R; Wattage: NA; Custom_Duty: 15%; Customs_HS_Code: 85322990; Project: G4_SVGA; Value: 0.01uF; PCB Footprint: CAP0402_0-75; Direct Alternate_mfr_name: TDK; Footprint Path: Y:\MIS_DATABASE\Library\ALTIUM_TOOL\PCB_FOOTPRINTS\Altium_Footprint_Lib.PcbLib; Library Path: Y:\MIS_DATABASE\Library\ALTIUM_TOOL\SCHEMATICS_PARTS\MS_DISCRETE_Library.schlib; MECHANICAL 3D STEP FILE: CAP0402_0-75; Temperature: -55°C+125°C; Weight: 0.65mg; Footprint Ref: CAP0402_0-75; Chkd/date: SHREESHAIL/301105; Crtd /date: MAZHAR/040505; Datasheet: Y:\MIS_DATABASE\DATASHEETS\CAPACITORS\KEMET-C-X7R.PDF; Height: 0.55MM; Library Ref: CAP; Distributor_part_number: 399-3066-1-ND; Distributor_name: DIGIKEY; Tolerance: 10%
C723 = CAP_Dup1: CAP CERAMIC 1uF 10V 10% X7S AUTO 0402; Part Reference: C723; Part_type: CAPACITORS\CERAMIC; Mfr_part_number: GCM155C71A105KE38D; Mfr_name: MURATA; Mistral Part No: 120018090021-R; Custom_Duty: 15%; Customs_HS_Code: 85322990; Wattage: NA; Project: SMART-M_SCRIPTALK_PB; Value: 1uF; PCB Footprint: CAP0402_0-75; Footprint Path: Y:\MIS_DATABASE\Library\ALTIUM_TOOL\PCB_FOOTPRINTS\Altium_Footprint_Lib.PcbLib; Library Path: Y:\MIS_DATABASE\Library\ALTIUM_TOOL\SCHEMATICS_PARTS\MS_DISCRETE_Library.schlib; MECHANICAL 3D STEP FILE: CAP0402_0-75; Chkd/date: MANIRAJA/100918; Crtd /date: ALVY/100918; Datasheet: Y:\MIS_DATABASE\DATASHEETS\CAPACITORS\MURATA-GCM-SER.PDF; Temperature: -55°C+125°C; Weight: 6mg; Height: 0.70MM; Distributor_part_number: 490-13409-1-ND; Distributor_name: DIGIKEY; Tolerance: 10%; Library Ref: CAP; Footprint Ref: CAP0402_0-75
C724 = CAP_Dup1: CAP CERAMIC 1uF 10V 10% X7S AUTO 0402; Part Reference: C724; Part_type: CAPACITORS\CERAMIC; Mfr_part_number: GCM155C71A105KE38D; Mfr_name: MURATA; Mistral Part No: 120018090021-R; Custom_Duty: 15%; Customs_HS_Code: 85322990; Wattage: NA; Project: SMART-M_SCRIPTALK_PB; Value: 1uF; PCB Footprint: CAP0402_0-75; Footprint Path: Y:\MIS_DATABASE\Library\ALTIUM_TOOL\PCB_FOOTPRINTS\Altium_Footprint_Lib.PcbLib; Library Path: Y:\MIS_DATABASE\Library\ALTIUM_TOOL\SCHEMATICS_PARTS\MS_DISCRETE_Library.schlib; MECHANICAL 3D STEP FILE: CAP0402_0-75; Chkd/date: MANIRAJA/100918; Crtd /date: ALVY/100918; Datasheet: Y:\MIS_DATABASE\DATASHEETS\CAPACITORS\MURATA-GCM-SER.PDF; Temperature: -55°C+125°C; Weight: 6mg; Height: 0.70MM; Distributor_part_number: 490-13409-1-ND; Distributor_name: DIGIKEY; Tolerance: 10%; Library Ref: CAP; Footprint Ref: CAP0402_0-75
C726 = CAP_Dup1: CAP CERAMIC 0.1uF 16V 5% X7R AUTO 0402; Part Reference: C726; Automotive Alternate_mfr_part_number: CGA2B1X7R1C104K050BC; Automotive Alternate_mfr_name: TDK; Mistral Part No: 120018100055-R; Mfr_name: MURATA; Mfr_part_number: GCM155R71C104JA55D; Part_type: CAPACITORS\CERAMIC; Project: TI_J7ES_EVM_CP; Wattage: NA; Customs_HS_Code: 85322990; Custom_Duty: 15%; Value: 0.1uF; PCB Footprint: CAP0402_0-75; Direct Alternate_mfr_part_number: CGA2B1X7R1C104K050BC; Direct Alternate_mfr_name: TDK; Tolerance: 5%; Distributor_name: DIGIKEY; Distributor_part_number: 490-16433-1-ND; Height: 0.55MM; Weight: 6mg; Temperature: -55°C+125°C; Datasheet: Y:\MIS_DATABASE\DATASHEETS\CAPACITORS\GCM155R71C104JA55D.PDF; Crtd /date: ALVY/241018; Chkd/date: MANIRAJA/241018; Library Ref: CAP; Footprint Ref: CAP0402_0-75; Library Path: Y:\MIS_DATABASE\Library\ALTIUM_TOOL\SCHEMATICS_PARTS\MS_DISCRETE_Library.schlib; Footprint Path: Y:\MIS_DATABASE\Library\ALTIUM_TOOL\PCB_FOOTPRINTS\Altium_Footprint_Lib.PcbLib; MECHANICAL 3D STEP FILE: CAP0402_0-75
C731 = CAP_Dup1: CAP CERAMIC 0.01uF 50V 10% X7R 0402; Part Reference: C731; Mistral Part No: 120009030025-R; Mfr_name: KEMET; Mfr_part_number: C0402C103K5RACTU; Part_type: CAPACITORS\CERAMIC; Direct Alternate_mfr_name: TDK; Direct Alternate_mfr_part_number: C1005X7R1H103K050BE; Automotive Alternate_mfr_part_number: CGA2B3X7R1H103K050BB; Project: G4_SVGA; Customs_HS_Code: 85322990; Custom_Duty: 15%; Wattage: NA; Value: 0.01uF; PCB Footprint: CAP0402_0-75; Tolerance: 10%; Distributor_name: DIGIKEY; Distributor_part_number: 399-3066-1-ND; Library Ref: CAP; Height: 0.55MM; Datasheet: Y:\MIS_DATABASE\DATASHEETS\CAPACITORS\KEMET-C-X7R.PDF; Crtd /date: MAZHAR/040505; Chkd/date: SHREESHAIL/301105; Footprint Ref: CAP0402_0-75; Weight: 0.65mg; Temperature: -55°C+125°C; MECHANICAL 3D STEP FILE: CAP0402_0-75; Library Path: Y:\MIS_DATABASE\Library\ALTIUM_TOOL\SCHEMATICS_PARTS\MS_DISCRETE_Library.schlib; Footprint Path: Y:\MIS_DATABASE\Library\ALTIUM_TOOL\PCB_FOOTPRINTS\Altium_Footprint_Lib.PcbLib; Automotive Alternate_mfr_name: TDK
C734 = CAP_Dup1: CAP CERAMIC 0.01uF 50V 10% X7R 0402; Part Reference: C734; Automotive Alternate_mfr_part_number: CGA2B3X7R1H103K050BB; Automotive Alternate_mfr_name: TDK; Direct Alternate_mfr_part_number: C1005X7R1H103K050BE; Part_type: CAPACITORS\CERAMIC; Mfr_part_number: C0402C103K5RACTU; Mfr_name: KEMET; Mistral Part No: 120009030025-R; Wattage: NA; Custom_Duty: 15%; Customs_HS_Code: 85322990; Project: G4_SVGA; Value: 0.01uF; PCB Footprint: CAP0402_0-75; Direct Alternate_mfr_name: TDK; Footprint Path: Y:\MIS_DATABASE\Library\ALTIUM_TOOL\PCB_FOOTPRINTS\Altium_Footprint_Lib.PcbLib; Library Path: Y:\MIS_DATABASE\Library\ALTIUM_TOOL\SCHEMATICS_PARTS\MS_DISCRETE_Library.schlib; MECHANICAL 3D STEP FILE: CAP0402_0-75; Temperature: -55°C+125°C; Weight: 0.65mg; Footprint Ref: CAP0402_0-75; Chkd/date: SHREESHAIL/301105; Crtd /date: MAZHAR/040505; Datasheet: Y:\MIS_DATABASE\DATASHEETS\CAPACITORS\KEMET-C-X7R.PDF; Height: 0.55MM; Library Ref: CAP; Distributor_part_number: 399-3066-1-ND; Distributor_name: DIGIKEY; Tolerance: 10%
C735 = CAP_Dup1: CAP CERAMIC 10uF 16V 20% X6S 0603; Part Reference: C735; Automotive Alternate_mfr_part_number: GRT188C81C106ME13D; Automotive Alternate_mfr_name: MURATA; Direct Alternate_mfr_part_number: CL10X106MO8NRNC; Direct Alternate_mfr_name: SAMSUNG; Part_type: CAPACITORS\CERAMIC; Mfr_part_number: GRM188C81C106MA73D; Mistral Part No: 120017010004-R; Custom_Duty: 15%; Customs_HS_Code: 85322990; Wattage: NA; Project: TRMM_SMART-M_PS; Value: 10uF; PCB Footprint: CAP0603_1; Footprint Path: Y:\MIS_DATABASE\Library\ALTIUM_TOOL\PCB_FOOTPRINTS\Altium_Footprint_Lib.PcbLib; Library Path: Y:\MIS_DATABASE\Library\ALTIUM_TOOL\SCHEMATICS_PARTS\MS_DISCRETE_Library.schlib; Footprint Ref: CAP0603_1; MECHANICAL 3D STEP FILE: CAP0603_1; Chkd/date: VASANTHA/170117; Crtd /date: VASANTHA/170117; Datasheet: Y:\MIS_DATABASE\DATASHEETS\CAPACITORS\MURATA-GXX-SER_NOV17.PDF; Temperature: -55°C+105°C; Weight: 6.3mg; Height: 0.90MM; Library Ref: CAP; Distributor_part_number: 490-7198-1-ND; Distributor_name: DIGIKEY; Tolerance: 20%; Mfr_name: MURATA
C739 = CAP_Dup1: CAP CERAMIC 0.01uF 50V 10% X7R 0402; Part Reference: C739; Automotive Alternate_mfr_part_number: CGA2B3X7R1H103K050BB; Automotive Alternate_mfr_name: TDK; Direct Alternate_mfr_part_number: C1005X7R1H103K050BE; Part_type: CAPACITORS\CERAMIC; Mfr_part_number: C0402C103K5RACTU; Mfr_name: KEMET; Mistral Part No: 120009030025-R; Wattage: NA; Custom_Duty: 15%; Customs_HS_Code: 85322990; Project: G4_SVGA; Value: 0.01uF; PCB Footprint: CAP0402_0-75; Direct Alternate_mfr_name: TDK; Footprint Path: Y:\MIS_DATABASE\Library\ALTIUM_TOOL\PCB_FOOTPRINTS\Altium_Footprint_Lib.PcbLib; Library Path: Y:\MIS_DATABASE\Library\ALTIUM_TOOL\SCHEMATICS_PARTS\MS_DISCRETE_Library.schlib; MECHANICAL 3D STEP FILE: CAP0402_0-75; Temperature: -55°C+125°C; Weight: 0.65mg; Footprint Ref: CAP0402_0-75; Chkd/date: SHREESHAIL/301105; Crtd /date: MAZHAR/040505; Datasheet: Y:\MIS_DATABASE\DATASHEETS\CAPACITORS\KEMET-C-X7R.PDF; Height: 0.55MM; Library Ref: CAP; Distributor_part_number: 399-3066-1-ND; Distributor_name: DIGIKEY; Tolerance: 10%
C740 = CAP_Dup1: CAP CERAMIC 0.01uF 50V 10% X7R 0402; Part Reference: C740; Automotive Alternate_mfr_part_number: CGA2B3X7R1H103K050BB; Automotive Alternate_mfr_name: TDK; Direct Alternate_mfr_part_number: C1005X7R1H103K050BE; Part_type: CAPACITORS\CERAMIC; Mfr_part_number: C0402C103K5RACTU; Mfr_name: KEMET; Mistral Part No: 120009030025-R; Wattage: NA; Custom_Duty: 15%; Customs_HS_Code: 85322990; Project: G4_SVGA; Value: 0.01uF; PCB Footprint: CAP0402_0-75; Direct Alternate_mfr_name: TDK; Footprint Path: Y:\MIS_DATABASE\Library\ALTIUM_TOOL\PCB_FOOTPRINTS\Altium_Footprint_Lib.PcbLib; Library Path: Y:\MIS_DATABASE\Library\ALTIUM_TOOL\SCHEMATICS_PARTS\MS_DISCRETE_Library.schlib; MECHANICAL 3D STEP FILE: CAP0402_0-75; Temperature: -55°C+125°C; Weight: 0.65mg; Footprint Ref: CAP0402_0-75; Chkd/date: SHREESHAIL/301105; Crtd /date: MAZHAR/040505; Datasheet: Y:\MIS_DATABASE\DATASHEETS\CAPACITORS\KEMET-C-X7R.PDF; Height: 0.55MM; Library Ref: CAP; Distributor_part_number: 399-3066-1-ND; Distributor_name: DIGIKEY; Tolerance: 10%
C742 = CAP_Dup1: CAP CERAMIC 0.01uF 50V 10% X7R 0402; Part Reference: C742; Mistral Part No: 120009030025-R; Mfr_name: KEMET; Mfr_part_number: C0402C103K5RACTU; Part_type: CAPACITORS\CERAMIC; Direct Alternate_mfr_name: TDK; Direct Alternate_mfr_part_number: C1005X7R1H103K050BE; Automotive Alternate_mfr_part_number: CGA2B3X7R1H103K050BB; Project: G4_SVGA; Customs_HS_Code: 85322990; Custom_Duty: 15%; Wattage: NA; Value: 0.01uF; PCB Footprint: CAP0402_0-75; Tolerance: 10%; Distributor_name: DIGIKEY; Distributor_part_number: 399-3066-1-ND; Library Ref: CAP; Height: 0.55MM; Datasheet: Y:\MIS_DATABASE\DATASHEETS\CAPACITORS\KEMET-C-X7R.PDF; Crtd /date: MAZHAR/040505; Chkd/date: SHREESHAIL/301105; Footprint Ref: CAP0402_0-75; Weight: 0.65mg; Temperature: -55°C+125°C; MECHANICAL 3D STEP FILE: CAP0402_0-75; Library Path: Y:\MIS_DATABASE\Library\ALTIUM_TOOL\SCHEMATICS_PARTS\MS_DISCRETE_Library.schlib; Footprint Path: Y:\MIS_DATABASE\Library\ALTIUM_TOOL\PCB_FOOTPRINTS\Altium_Footprint_Lib.PcbLib; Automotive Alternate_mfr_name: TDK
C743 = CAP_Dup1: CAP CERAMIC 0.01uF 50V 10% X7R 0402; Part Reference: C743; Mistral Part No: 120009030025-R; Mfr_name: KEMET; Mfr_part_number: C0402C103K5RACTU; Part_type: CAPACITORS\CERAMIC; Direct Alternate_mfr_name: TDK; Direct Alternate_mfr_part_number: C1005X7R1H103K050BE; Automotive Alternate_mfr_part_number: CGA2B3X7R1H103K050BB; Project: G4_SVGA; Customs_HS_Code: 85322990; Custom_Duty: 15%; Wattage: NA; Value: 0.01uF; PCB Footprint: CAP0402_0-75; Tolerance: 10%; Distributor_name: DIGIKEY; Distributor_part_number: 399-3066-1-ND; Library Ref: CAP; Height: 0.55MM; Datasheet: Y:\MIS_DATABASE\DATASHEETS\CAPACITORS\KEMET-C-X7R.PDF; Crtd /date: MAZHAR/040505; Chkd/date: SHREESHAIL/301105; Footprint Ref: CAP0402_0-75; Weight: 0.65mg; Temperature: -55°C+125°C; MECHANICAL 3D STEP FILE: CAP0402_0-75; Library Path: Y:\MIS_DATABASE\Library\ALTIUM_TOOL\SCHEMATICS_PARTS\MS_DISCRETE_Library.schlib; Footprint Path: Y:\MIS_DATABASE\Library\ALTIUM_TOOL\PCB_FOOTPRINTS\Altium_Footprint_Lib.PcbLib; Automotive Alternate_mfr_name: TDK
C744 = CAP_Dup1: CAP CERAMIC 0.01uF 50V 10% X7R 0402; Part Reference: C744; Mistral Part No: 120009030025-R; Mfr_name: KEMET; Mfr_part_number: C0402C103K5RACTU; Part_type: CAPACITORS\CERAMIC; Direct Alternate_mfr_name: TDK; Direct Alternate_mfr_part_number: C1005X7R1H103K050BE; Automotive Alternate_mfr_part_number: CGA2B3X7R1H103K050BB; Project: G4_SVGA; Customs_HS_Code: 85322990; Custom_Duty: 15%; Wattage: NA; Value: 0.01uF; PCB Footprint: CAP0402_0-75; Tolerance: 10%; Distributor_name: DIGIKEY; Distributor_part_number: 399-3066-1-ND; Library Ref: CAP; Height: 0.55MM; Datasheet: Y:\MIS_DATABASE\DATASHEETS\CAPACITORS\KEMET-C-X7R.PDF; Crtd /date: MAZHAR/040505; Chkd/date: SHREESHAIL/301105; Footprint Ref: CAP0402_0-75; Weight: 0.65mg; Temperature: -55°C+125°C; MECHANICAL 3D STEP FILE: CAP0402_0-75; Library Path: Y:\MIS_DATABASE\Library\ALTIUM_TOOL\SCHEMATICS_PARTS\MS_DISCRETE_Library.schlib; Footprint Path: Y:\MIS_DATABASE\Library\ALTIUM_TOOL\PCB_FOOTPRINTS\Altium_Footprint_Lib.PcbLib; Automotive Alternate_mfr_name: TDK
C745 = CAP_Dup1: CAP CERAMIC 0.01uF 50V 10% X7R 0402; Part Reference: C745; Automotive Alternate_mfr_part_number: CGA2B3X7R1H103K050BB; Automotive Alternate_mfr_name: TDK; Direct Alternate_mfr_part_number: C1005X7R1H103K050BE; Part_type: CAPACITORS\CERAMIC; Mfr_part_number: C0402C103K5RACTU; Mfr_name: KEMET; Mistral Part No: 120009030025-R; Wattage: NA; Custom_Duty: 15%; Customs_HS_Code: 85322990; Project: G4_SVGA; Value: 0.01uF; PCB Footprint: CAP0402_0-75; Direct Alternate_mfr_name: TDK; Footprint Path: Y:\MIS_DATABASE\Library\ALTIUM_TOOL\PCB_FOOTPRINTS\Altium_Footprint_Lib.PcbLib; Library Path: Y:\MIS_DATABASE\Library\ALTIUM_TOOL\SCHEMATICS_PARTS\MS_DISCRETE_Library.schlib; MECHANICAL 3D STEP FILE: CAP0402_0-75; Temperature: -55°C+125°C; Weight: 0.65mg; Footprint Ref: CAP0402_0-75; Chkd/date: SHREESHAIL/301105; Crtd /date: MAZHAR/040505; Datasheet: Y:\MIS_DATABASE\DATASHEETS\CAPACITORS\KEMET-C-X7R.PDF; Height: 0.55MM; Library Ref: CAP; Distributor_part_number: 399-3066-1-ND; Distributor_name: DIGIKEY; Tolerance: 10%
C747 = CAP_Dup1: CAP CERAMIC 0.01uF 50V 10% X7R 0402; Part Reference: C747; Mistral Part No: 120009030025-R; Mfr_name: KEMET; Mfr_part_number: C0402C103K5RACTU; Part_type: CAPACITORS\CERAMIC; Direct Alternate_mfr_name: TDK; Direct Alternate_mfr_part_number: C1005X7R1H103K050BE; Automotive Alternate_mfr_part_number: CGA2B3X7R1H103K050BB; Project: G4_SVGA; Customs_HS_Code: 85322990; Custom_Duty: 15%; Wattage: NA; Value: 0.01uF; PCB Footprint: CAP0402_0-75; Tolerance: 10%; Distributor_name: DIGIKEY; Distributor_part_number: 399-3066-1-ND; Library Ref: CAP; Height: 0.55MM; Datasheet: Y:\MIS_DATABASE\DATASHEETS\CAPACITORS\KEMET-C-X7R.PDF; Crtd /date: MAZHAR/040505; Chkd/date: SHREESHAIL/301105; Footprint Ref: CAP0402_0-75; Weight: 0.65mg; Temperature: -55°C+125°C; MECHANICAL 3D STEP FILE: CAP0402_0-75; Library Path: Y:\MIS_DATABASE\Library\ALTIUM_TOOL\SCHEMATICS_PARTS\MS_DISCRETE_Library.schlib; Footprint Path: Y:\MIS_DATABASE\Library\ALTIUM_TOOL\PCB_FOOTPRINTS\Altium_Footprint_Lib.PcbLib; Automotive Alternate_mfr_name: TDK
C756 = CAP_Dup1: CAP CERAMIC 0.1uF 16V 5% X7R AUTO 0402; Part Reference: C756; Part_type: CAPACITORS\CERAMIC; Mfr_part_number: GCM155R71C104JA55D; Mfr_name: MURATA; Mistral Part No: 120018100055-R; Direct Alternate_mfr_name: TDK; Direct Alternate_mfr_part_number: CGA2B1X7R1C104K050BC; Custom_Duty: 15%; Customs_HS_Code: 85322990; Wattage: NA; Project: TI_J7ES_EVM_CP; Value: 0.1uF; PCB Footprint: CAP0402_0-75; MECHANICAL 3D STEP FILE: CAP0402_0-75; Footprint Path: Y:\MIS_DATABASE\Library\ALTIUM_TOOL\PCB_FOOTPRINTS\Altium_Footprint_Lib.PcbLib; Library Path: Y:\MIS_DATABASE\Library\ALTIUM_TOOL\SCHEMATICS_PARTS\MS_DISCRETE_Library.schlib; Footprint Ref: CAP0402_0-75; Library Ref: CAP; Chkd/date: MANIRAJA/241018; Crtd /date: ALVY/241018; Datasheet: Y:\MIS_DATABASE\DATASHEETS\CAPACITORS\GCM155R71C104JA55D.PDF; Temperature: -55°C+125°C; Weight: 6mg; Height: 0.55MM; Distributor_part_number: 490-16433-1-ND; Distributor_name: DIGIKEY; Tolerance: 5%; Automotive Alternate_mfr_name: TDK; Automotive Alternate_mfr_part_number: CGA2B1X7R1C104K050BC
C757 = CAP_Dup1: CAP CERAMIC 10uF 16V 20% X6S 0603; Part Reference: C757; Automotive Alternate_mfr_part_number: GRT188C81C106ME13D; Automotive Alternate_mfr_name: MURATA; Direct Alternate_mfr_part_number: CL10X106MO8NRNC; Direct Alternate_mfr_name: SAMSUNG; Part_type: CAPACITORS\CERAMIC; Mfr_part_number: GRM188C81C106MA73D; Mistral Part No: 120017010004-R; Custom_Duty: 15%; Customs_HS_Code: 85322990; Wattage: NA; Project: TRMM_SMART-M_PS; Value: 10uF; PCB Footprint: CAP0603_1; Footprint Path: Y:\MIS_DATABASE\Library\ALTIUM_TOOL\PCB_FOOTPRINTS\Altium_Footprint_Lib.PcbLib; Library Path: Y:\MIS_DATABASE\Library\ALTIUM_TOOL\SCHEMATICS_PARTS\MS_DISCRETE_Library.schlib; Footprint Ref: CAP0603_1; MECHANICAL 3D STEP FILE: CAP0603_1; Chkd/date: VASANTHA/170117; Crtd /date: VASANTHA/170117; Datasheet: Y:\MIS_DATABASE\DATASHEETS\CAPACITORS\MURATA-GXX-SER_NOV17.PDF; Temperature: -55°C+105°C; Weight: 6.3mg; Height: 0.90MM; Library Ref: CAP; Distributor_part_number: 490-7198-1-ND; Distributor_name: DIGIKEY; Tolerance: 20%; Mfr_name: MURATA
C758 = CAP_Dup1: CAP CERAMIC 0.01uF 50V 10% X7R 0402; Part Reference: C758; Mistral Part No: 120009030025-R; Mfr_name: KEMET; Mfr_part_number: C0402C103K5RACTU; Part_type: CAPACITORS\CERAMIC; Direct Alternate_mfr_name: TDK; Direct Alternate_mfr_part_number: C1005X7R1H103K050BE; Automotive Alternate_mfr_part_number: CGA2B3X7R1H103K050BB; Project: G4_SVGA; Customs_HS_Code: 85322990; Custom_Duty: 15%; Wattage: NA; Value: 0.01uF; PCB Footprint: CAP0402_0-75; Tolerance: 10%; Distributor_name: DIGIKEY; Distributor_part_number: 399-3066-1-ND; Library Ref: CAP; Height: 0.55MM; Datasheet: Y:\MIS_DATABASE\DATASHEETS\CAPACITORS\KEMET-C-X7R.PDF; Crtd /date: MAZHAR/040505; Chkd/date: SHREESHAIL/301105; Footprint Ref: CAP0402_0-75; Weight: 0.65mg; Temperature: -55°C+125°C; MECHANICAL 3D STEP FILE: CAP0402_0-75; Library Path: Y:\MIS_DATABASE\Library\ALTIUM_TOOL\SCHEMATICS_PARTS\MS_DISCRETE_Library.schlib; Footprint Path: Y:\MIS_DATABASE\Library\ALTIUM_TOOL\PCB_FOOTPRINTS\Altium_Footprint_Lib.PcbLib; Automotive Alternate_mfr_name: TDK
R483 = RESISTOR_Dup2: RES 10K 1/16W 1% 0402; Part Reference: R483; Part_type: RESISTORS\FIXED; Mfr_part_number: RC0402FR-0710KL; Mfr_name: YAGEO AMERICA; Mistral Part No: 110015090015-R; Custom_Duty: 15%; Customs_HS_Code: 85332119; Voltage: NA; Project: VOCERA; Value: 10K_1%; PCB Footprint: RES0402_0-5; MECHANICAL 3D STEP FILE: RES0402_0-5; Chkd/date: VASANTHA/201216; Crtd /date: GEETHA/290506; Datasheet: Y:\MIS_DATABASE\DATASHEETS\RESISTORS\RCXXXXL-SER_MAR18.PDF; Temperature: -55°C+155°C; Weight: 0.65mg; Height: 0.40MM; Distributor_part_number: 311-10.0KLRTR-ND; Distributor_name: DIGIKEY; Package: 0402; Wattage: 1/16W; Tolerance: 1%; Library Ref: RESISTOR; Footprint Ref: RES0402_0-5; Library Path: Y:\MIS_DATABASE\Library\ALTIUM_TOOL\SCHEMATICS_PARTS\MS_DISCRETE_Library.schlib; Footprint Path: Y:\MIS_DATABASE\Library\ALTIUM_TOOL\PCB_FOOTPRINTS\Altium_Footprint_Lib.PcbLib
R485 = RESISTOR_Dup1: RES 1K 1/10W 1% 0402; Part Reference: R485; Manufacturer: PANASONIC-ECG; Part_type: RESISTORS\FIXED; Mfr_part_number: ERJ-2RKF1001X; Mistral Part No: 110009030411-R; Custom_Duty: 15%; Customs_HS_Code: 85332119; Voltage: NA; Project: VOCERA; Value: 1K_1%; PCB Footprint: RES0402_0-5; Footprint Path: Y:\MIS_DATABASE\Library\ALTIUM_TOOL\PCB_FOOTPRINTS\Altium_Footprint_Lib.PcbLib; Library Path: Y:\MIS_DATABASE\Library\ALTIUM_TOOL\SCHEMATICS_PARTS\MS_DISCRETE_Library.schlib; MECHANICAL 3D STEP FILE: RES0402_0-5; Footprint Ref: RES0402_0-5; Library Ref: RESISTOR; Chkd/date: VASANTHA/281216; Crtd /date: MAZHAR/150506; Datasheet: Y:\MIS_DATABASE\DATASHEETS\RESISTORS\PAN-ERJSER_NOV17.PDF; Temperature: -55°C+155°C; Weight: 0.8mg; Height: 0.40MM; Distributor_part_number: P1.00KLCT-ND; Distributor_name: DIGIKEY; Package: 0402; Wattage: 1/10W; Tolerance: 1%; Mfr_name: PANASONIC-ECG
R499 = RESISTOR_Dup2: RES 240E 1/20W 1% 0201; Part Reference: R499; Mistral Part No: 110016110007-R; Mfr_name: YAGEO AMERICA; Mfr_part_number: RC0201FR-07240RL; Part_type: RESISTORS\FIXED; Project: ALL_DATA_NANO_SOM; Voltage: NA; Customs_HS_Code: 85332119; Custom_Duty: 15%; Value: 240E_1%; Wattage: 1/20W; Package: 0201; Distributor_name: DIGIKEY; Distributor_part_number: YAG2528CT-ND; Library Ref: RESISTOR; Height: 0.26MM; Weight: 0.17mg; Temperature: -55°C+125°C; Datasheet: Y:\MIS_DATABASE\DATASHEETS\RESISTORS\RCXXXXL-SER_MAR18.PDF; Crtd /date: MANIRAJA/241116; Chkd/date: VASANTHA/251116; MECHANICAL 3D STEP FILE: RES0201_0-5; Footprint Ref: RES0201_0-5; Library Path: Y:\MIS_DATABASE\Library\ALTIUM_TOOL\SCHEMATICS_PARTS\MS_DISCRETE_Library.schlib; Footprint Path: Y:\MIS_DATABASE\Library\ALTIUM_TOOL\PCB_FOOTPRINTS\Altium_Footprint_Lib.PcbLib; PCB Footprint: RES0201_0-5
R501 = RESISTOR_Dup2: RES 240E 1/20W 1% 0201; Part Reference: R501; Mistral Part No: 110016110007-R; Mfr_name: YAGEO AMERICA; Mfr_part_number: RC0201FR-07240RL; Part_type: RESISTORS\FIXED; Project: ALL_DATA_NANO_SOM; Voltage: NA; Customs_HS_Code: 85332119; Custom_Duty: 15%; Value: 240E_1%; PCB Footprint: RES0201_0-5; Wattage: 1/20W; Package: 0201; Distributor_name: DIGIKEY; Distributor_part_number: YAG2528CT-ND; Library Ref: RESISTOR; Height: 0.26MM; Weight: 0.17mg; Temperature: -55°C+125°C; Datasheet: Y:\MIS_DATABASE\DATASHEETS\RESISTORS\RCXXXXL-SER_MAR18.PDF; Crtd /date: MANIRAJA/241116; Chkd/date: VASANTHA/251116; MECHANICAL 3D STEP FILE: RES0201_0-5; Footprint Ref: RES0201_0-5; Library Path: Y:\MIS_DATABASE\Library\ALTIUM_TOOL\SCHEMATICS_PARTS\MS_DISCRETE_Library.schlib; Footprint Path: Y:\MIS_DATABASE\Library\ALTIUM_TOOL\PCB_FOOTPRINTS\Altium_Footprint_Lib.PcbLib
R518 = RESISTOR_Dup2: RES 10K 1/16W 1% 0402; Part Reference: R518; Part_type: RESISTORS\FIXED; Mfr_part_number: RC0402FR-0710KL; Mfr_name: YAGEO AMERICA; Mistral Part No: 110015090015-R; Custom_Duty: 15%; Customs_HS_Code: 85332119; Voltage: NA; Project: VOCERA; Value: 10K_1%; PCB Footprint: RES0402_0-5; MECHANICAL 3D STEP FILE: RES0402_0-5; Chkd/date: VASANTHA/201216; Crtd /date: GEETHA/290506; Datasheet: Y:\MIS_DATABASE\DATASHEETS\RESISTORS\RCXXXXL-SER_MAR18.PDF; Temperature: -55°C+155°C; Weight: 0.65mg; Height: 0.40MM; Distributor_part_number: 311-10.0KLRTR-ND; Distributor_name: DIGIKEY; Package: 0402; Wattage: 1/16W; Tolerance: 1%; Library Ref: RESISTOR; Footprint Ref: RES0402_0-5; Library Path: Y:\MIS_DATABASE\Library\ALTIUM_TOOL\SCHEMATICS_PARTS\MS_DISCRETE_Library.schlib; Footprint Path: Y:\MIS_DATABASE\Library\ALTIUM_TOOL\PCB_FOOTPRINTS\Altium_Footprint_Lib.PcbLib
R520 = RESISTOR_Dup2: RES 10K 1/16W 1% 0402; Part Reference: R520; Part_type: RESISTORS\FIXED; Mfr_part_number: RC0402FR-0710KL; Mfr_name: YAGEO AMERICA; Mistral Part No: 110015090015-R; Custom_Duty: 15%; Customs_HS_Code: 85332119; Voltage: NA; Project: VOCERA; Value: 10K_1%; PCB Footprint: RES0402_0-5; MECHANICAL 3D STEP FILE: RES0402_0-5; Chkd/date: VASANTHA/201216; Crtd /date: GEETHA/290506; Datasheet: Y:\MIS_DATABASE\DATASHEETS\RESISTORS\RCXXXXL-SER_MAR18.PDF; Temperature: -55°C+155°C; Weight: 0.65mg; Height: 0.40MM; Distributor_part_number: 311-10.0KLRTR-ND; Distributor_name: DIGIKEY; Package: 0402; Wattage: 1/16W; Tolerance: 1%; Library Ref: RESISTOR; Footprint Ref: RES0402_0-5; Library Path: Y:\MIS_DATABASE\Library\ALTIUM_TOOL\SCHEMATICS_PARTS\MS_DISCRETE_Library.schlib; Footprint Path: Y:\MIS_DATABASE\Library\ALTIUM_TOOL\PCB_FOOTPRINTS\Altium_Footprint_Lib.PcbLib
R524 = RESISTOR_Dup2: RES 240E 1/20W 1% 0201; Part Reference: R524; Part_type: RESISTORS\FIXED; Mfr_part_number: RC0201FR-07240RL; Mfr_name: YAGEO AMERICA; Mistral Part No: 110016110007-R; Part #: 103413-2401R; Custom_Duty: 15%; Customs_HS_Code: 85332119; Voltage: NA; Project: ALL_DATA_NANO_SOM; Value: 240E_1%; PCB Footprint: RES0201_0-5; MECHANICAL 3D STEP FILE: RES0201_0-5; Chkd/date: VASANTHA/251116; Crtd /date: MANIRAJA/241116; Datasheet: Y:\MIS_DATABASE\DATASHEETS\RESISTORS\RCXXXXL-SER_MAR18.PDF; Temperature: -55°C+125°C; Weight: 0.17mg; Height: 0.26MM; Library Ref: RESISTOR; Distributor_part_number: YAG2528CT-ND; Distributor_name: DIGIKEY; Wattage: 1/20W; Tolerance: 1%; Footprint Ref: RES0201_0-5; Library Path: Y:\MIS_DATABASE\Library\ALTIUM_TOOL\SCHEMATICS_PARTS\MS_DISCRETE_Library.schlib; Footprint Path: Y:\MIS_DATABASE\Library\ALTIUM_TOOL\PCB_FOOTPRINTS\Altium_Footprint_Lib.PcbLib; Manufacturer: YAGEO AMERICA
U28 = J7AHPSoC-EVM_BGA1414: IC AM69 SoC EVM MICROPROCESSOR BGA1414; Part Reference: U28; Part_type: ICS\DIGITAL\MICROPROCESSOR; Mfr_name: TEXAS INSTRUMENTS; Mistral Part No: 141230020002; SPLIT_INST: TRUE; SWAP_INFO: (S1+S2+S3+S4+S5+S6+S7+S8+S9+S10+S11+S12+S13+S14+S15+S16+S17+S18+S19+S20+S21+S22+S23+S24+S25+S26); Custom_Duty: 15%; Customs_HS_Code: 85423100; Wattage: NA; Project: TI_J7AHP SK_BRD; Value: XJ784S45AALY; Footprint Path: Y:\MIS_DATABASE\Library\ALTIUM_TOOL\PCB_FOOTPRINTS\Altium_Footprint_Lib.PcbLib; Library Path: Y:\MIS_DATABASE\Library\ALTIUM_TOOL\SCHEMATICS_PARTS\MS_MICROPROCESSOR_Library.schlib; MECHANICAL 3D STEP FILE: BGA1414_31-49_1230X1230_2-7; RoHS: NA; Chkd/date: MANIRAJA/151221; Crtd /date: ALVY/141221; Datasheet: Y:\MIS_DATABASE\DATASHEETS\ICS\DIGITAL\MICROCONTROLLER\J7AHP-SoC-EVM.PDF; Temperature: NA; Weight: NA; Height: 2.70MM; Library Ref: J7AHPSoC-EVM_BGA1414; Distributor_part_number: NA; Distributor_name: NA; Package: BGA1414; Voltage: NA; Tolerance: NA; Mfr_part_number: XJ784S45AALY; Footprint Ref: BGA1414_31-49_1230X1230_2-7; Manufacturer: TEXAS INSTRUMENTS; PCB Footprint: BGA1414_31-49_1230X1230_2-7
U45 = MT53D1024M32D4DT_VFBGA200: IC 8Gb AUTO LPDDR4/LPDDR4x SDRAM TFBGA200; Part Reference: U45; Part_type: ICS\DIGITAL\MEMORY; Mfr_name: MICRON; Mistral Part No: 141122010003-R; MECHANICAL 3D STEP FILE: WFBGA200_MT53E2G_400X570_1-2; Custom_Duty: 15%; Customs_HS_Code: 85423100; Wattage: NA; Project: J7AHP_PROTO_BRD; Value: MT53E2G32D4DE-046 AUT:C; PCB Footprint: WFBGA200_MT53DDS_400X570_1-2; Footprint Path: Y:\MIS_DATABASE\Library\ALTIUM_TOOL\PCB_FOOTPRINTS\Altium_Footprint_Lib.PcbLib; Library Path: Y:\MIS_DATABASE\Library\ALTIUM_TOOL\SCHEMATICS_PARTS\MS_MISCMEMORY_Library.schlib; Chkd/date: ALVY/170122; Crtd /date: MANIRAJA/170122; Datasheet: Y:\MIS_DATABASE\DATASHEETS\ICS\MEMORY\MT53EX-C-AUTO.PDF; Temperature: -40°C+125°C; Weight: NA; Height: 1.14MM; Library Ref: MT53D1024M32D4DT_VFBGA200; Distributor_part_number: NA; Distributor_name: NA; Package: TFBGA200; Voltage: NA; Tolerance: NA; Mfr_part_number: MT53E2G32D4DE-046 AUT:C; Footprint Ref: WFBGA200_MT53DDS_400X570_1-2; Manufacturer: MICRON